# EAGLE schematic Test_Board (EAGLE 9.2.2)
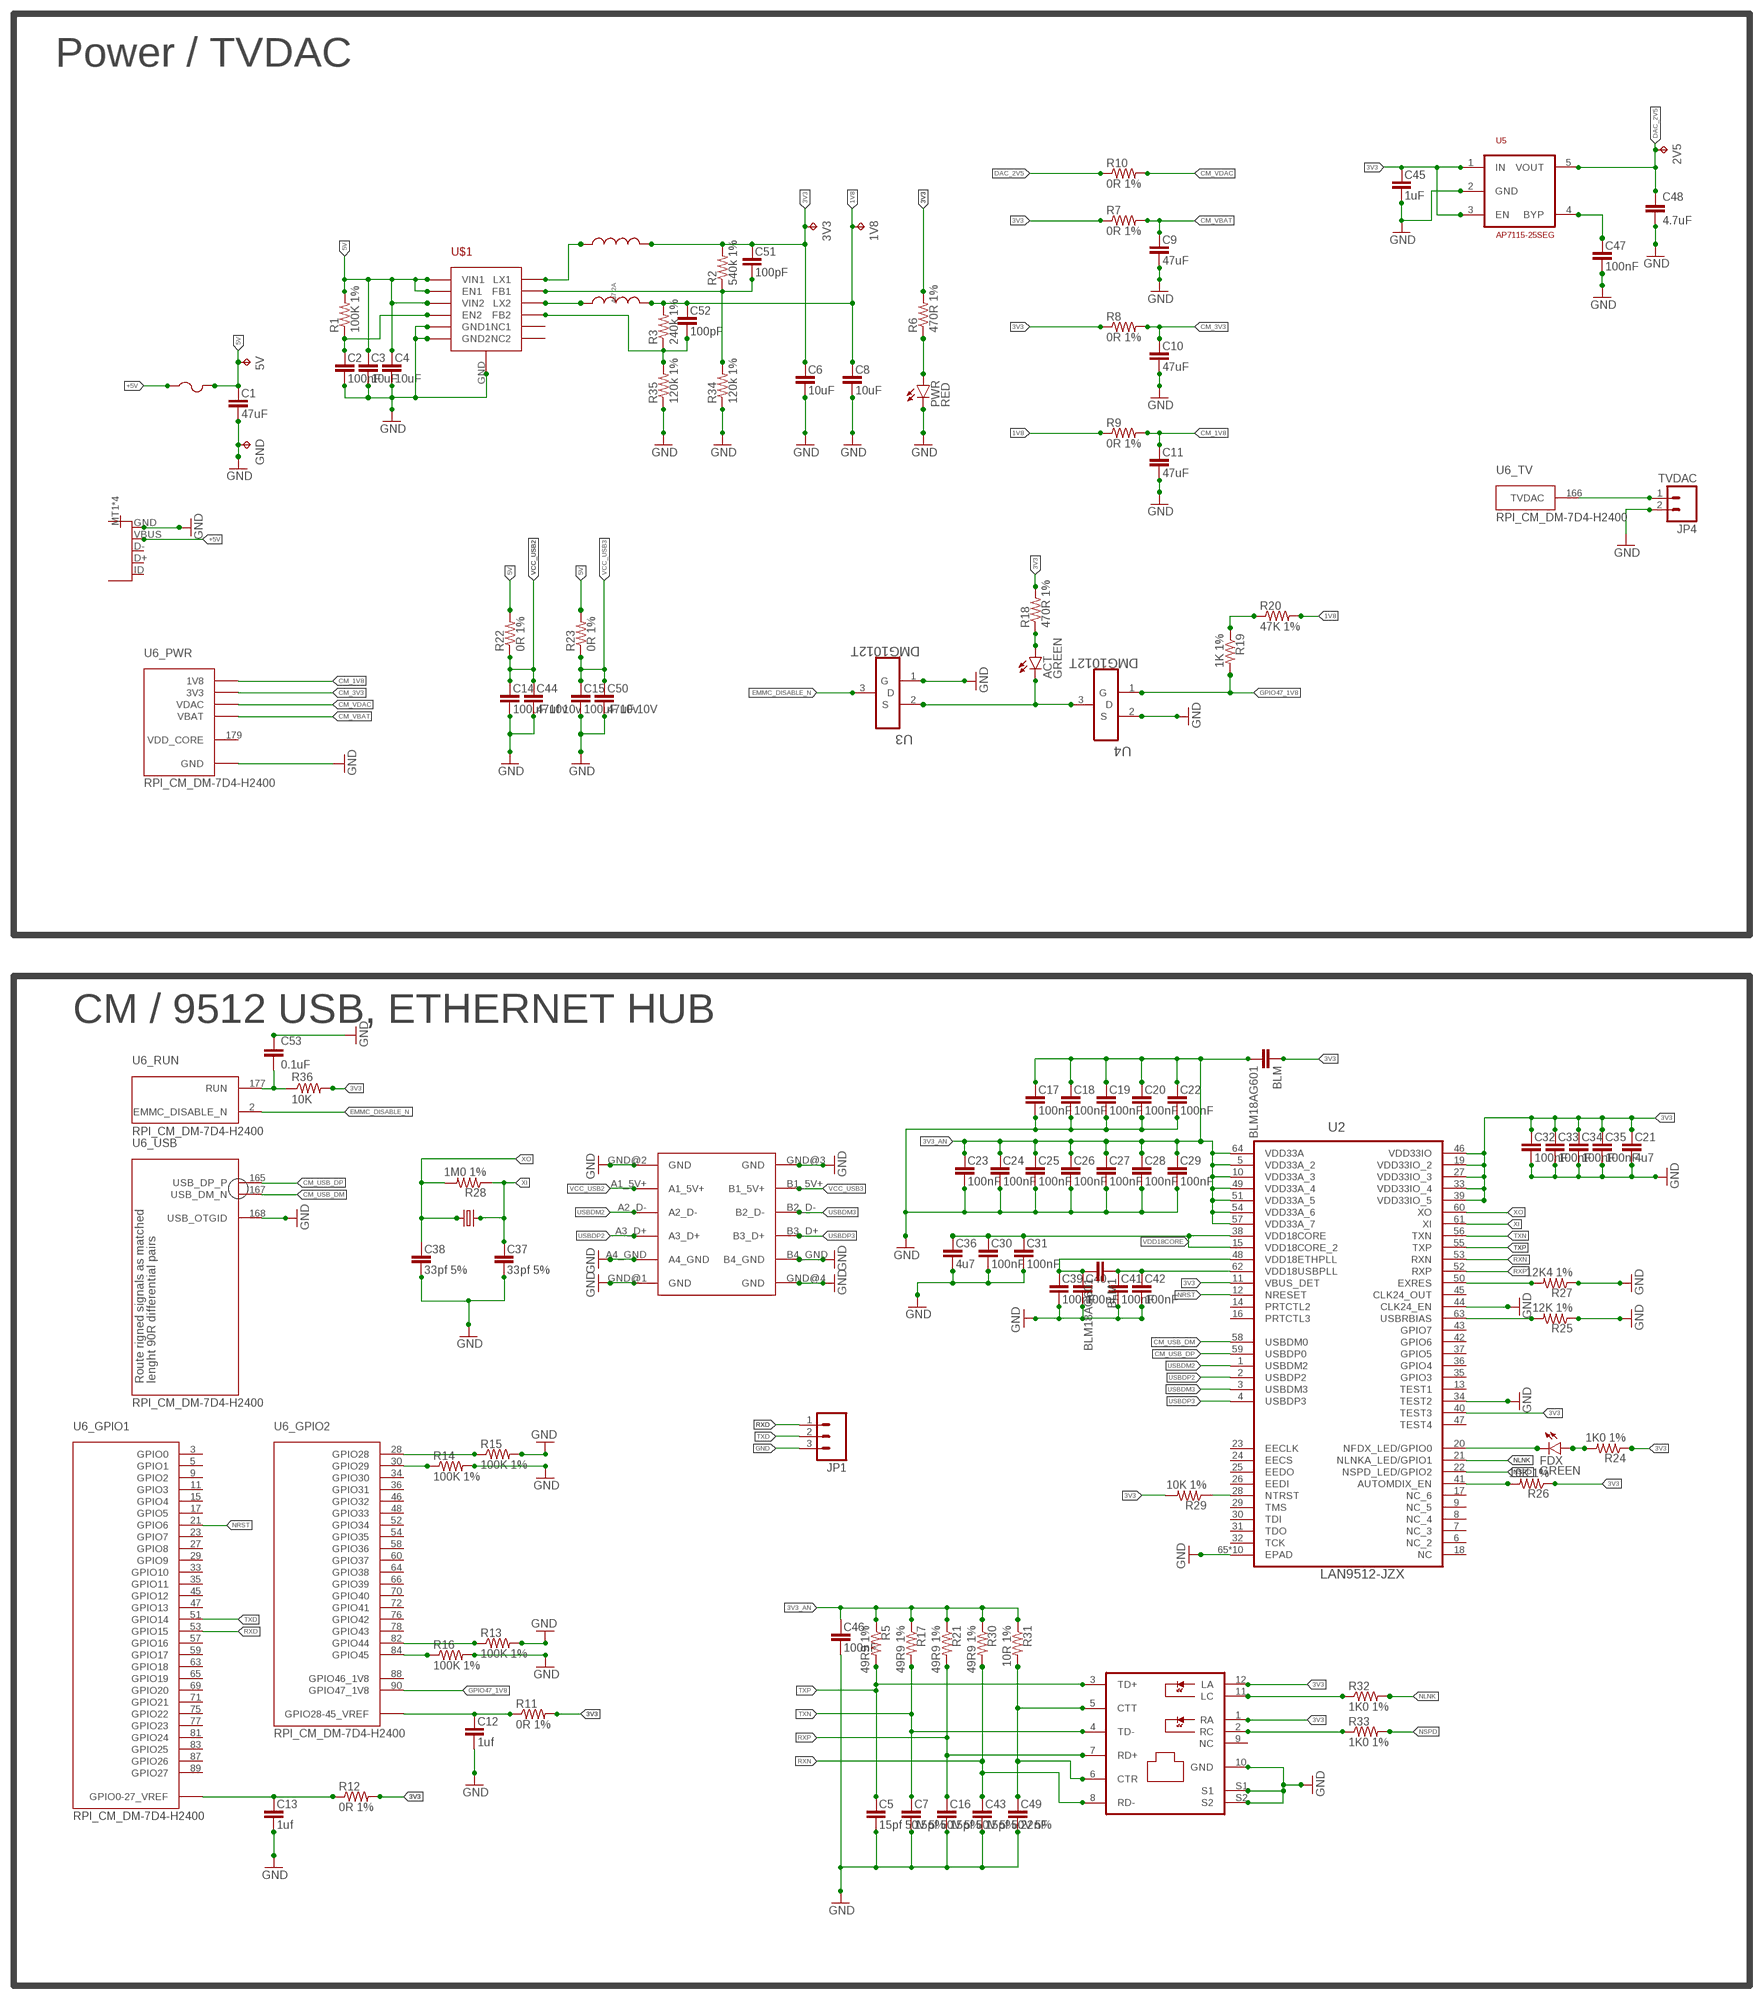
[diagram p0: schematic, sheet 1]

## Parts
1V8  TPB1,27  [B1,27]
2V5  TPB1,27  [B1,27]
3V3  TPB1,27  [B1,27]
5V  TPB1,27  [B1,27]
ACT  GREEN  LED0603  [LED-0603]
BLM  BLM18AG601  0.1UF-25V-5%(0603)  [0603-CAP]
BLM1  BLM18AG601  0.1UF-25V-5%(0603)  [0603-CAP]
C1  47uF  C_1206  [1206]
C2  100nF  C_0402  [0402]
C3  10uF  C_0805  [0805]
C4  10uF  C_0805  [0805]
C5  15pf 50V 5%  C_0402  [0402]
C6  10uF  C_0805  [0805]
C7  15pf 50V 5%  C_0402  [0402]
C8  10uF  C_0805  [0805]
C9  47uF  C_1206  [1206]
C10  47uF  C_1206  [1206]
C11  47uF  C_1206  [1206]
C12  1uf  C_0402  [0402]
C13  1uf  C_0402  [0402]
C14  100uF 10v  C_1206  [1206]
C15  100uF 10v  C_1206  [1206]
C16  15pf 50V 5%  C_0402  [0402]
C17  100nF  C_0402  [0402]
C18  100nF  C_0402  [0402]
C19  100nF  C_0402  [0402]
C20  100nF  C_0402  [0402]
C21  4u7  C_0402  [0402]
C22  100nF  C_0402  [0402]
C23  100nF  C_0402  [0402]
C24  100nF  C_0402  [0402]
C25  100nF  C_0402  [0402]
C26  100nF  C_0402  [0402]
C27  100nF  C_0402  [0402]
C28  100nF  C_0402  [0402]
C29  100nF  C_0402  [0402]
C30  100nF  C_0402  [0402]
C31  100nF  C_0402  [0402]
C32  100nF  C_0402  [0402]
C33  100nF  C_0402  [0402]
C34  100nF  C_0402  [0402]
C35  100nF  C_0402  [0402]
C36  4u7  C_0402  [0402]
C37  33pf 5%  C_0402  [0402]
C38  33pf 5%  C_0402  [0402]
C39  100nF  C_0402  [0402]
C40  100nF  C_0402  [0402]
C41  100nF  C_0402  [0402]
C42  100nF  C_0402  [0402]
C43  15pf 50V 5%  C_0402  [0402]
C44  47uf 10v  C_0805  [0805]
C45  1uF  C_0402  [0402]
C46  100nF  C_0402  [0402]
C47  100nF  C_0402  [0402]
C48  4.7uF  4.7UF-6.3V-10%(0603)0603  [0603-CAP]
C49  22nF  C_0805  [0805]
C50  47uF 10V  C_0805  [0805]
C51  100pF  C_0402  [0402]
C52  100pF  C_0402  [0402]
C53  0.1uF  0.1UF-25V-5%(0603)  [0603-CAP]
F1  PTCFUSE-1812  [1812]
FDX  GREEN  LED0603  [LED-0603]
GND  TPB1,27  [B1,27]
J1  J3011  [J30]
JP1  M03PTH  [1X03]
JP3  USB-IDMICRO  [USB-MICRO]
JP4  TVDAC  M02PTH  [1X02]
L1  4.7u 2A  INDUCTOR-SRN4018  [SRN4018]
L2  4.7u 2A  INDUCTOR-SRN4018  [SRN4018]
PWR  RED  LED0603  [LED-0603]
R1  100K 1%  RESISTOR0402-RES  [0402-RES]
R2  540k 1%  RESISTOR0402-RES  [0402-RES]
R3  240k 1%  RESISTOR0402-RES  [0402-RES]
R5  49R9 1%  RESISTOR0402-RES  [0402-RES]
R6  470R 1%  RESISTOR0402-RES  [0402-RES]
R7  0R 1%  RESISTOR0402-RES  [0402-RES]
R8  0R 1%  RESISTOR0402-RES  [0402-RES]
R9  0R 1%  RESISTOR0402-RES  [0402-RES]
R10  0R 1%  RESISTOR0402-RES  [0402-RES]
R11  0R 1%  RESISTOR0402-RES  [0402-RES]
R12  0R 1%  RESISTOR0402-RES  [0402-RES]
R13  100K 1%  RESISTOR0402-RES  [0402-RES]
R14  100K 1%  RESISTOR0402-RES  [0402-RES]
R15  100K 1%  RESISTOR0402-RES  [0402-RES]
R16  100K 1%  RESISTOR0402-RES  [0402-RES]
R17  49R9 1%  RESISTOR0402-RES  [0402-RES]
R18  470R 1%  RESISTOR0402-RES  [0402-RES]
R19  1K 1%  RESISTOR0402-RES  [0402-RES]
R20  47K 1%  RESISTOR0402-RES  [0402-RES]
R21  49R9 1%  RESISTOR0402-RES  [0402-RES]
R22  0R 1%  RESISTOR0402-RES  [0402-RES]
R23  0R 1%  RESISTOR0402-RES  [0402-RES]
R24  1K0 1%  RESISTOR0402-RES  [0402-RES]
R25  12K 1%  RESISTOR0402-RES  [0402-RES]
R26  10K 1%  RESISTOR0402-RES  [0402-RES]
R27  12K4 1%  RESISTOR0402-RES  [0402-RES]
R28  1M0 1%  RESISTOR0402-RES  [0402-RES]
R29  10K 1%  RESISTOR0402-RES  [0402-RES]
R30  49R9 1%  RESISTOR0402-RES  [0402-RES]
R31  10R 1%  RESISTOR0402-RES  [0402-RES]
R32  1K0 1%  RESISTOR0402-RES  [0402-RES]
R33  1K0 1%  RESISTOR0402-RES  [0402-RES]
R34  120k 1%  RESISTOR0402-RES  [0402-RES]
R35  120k 1%  RESISTOR0402-RES  [0402-RES]
R36  10K  RESISTOR0402-RES  [0402-RES]
U2  LAN9512-JZX  [QFN50P900X900X100-65N]
U3  DMG1012T  [SOT50P160X90-3N]
U4  DMG1012T  [SOT50P160X90-3N]
U5  AP7115-25SEG  74LVC1G79GW  [SOT353]
U6  RPI_CM_DM-7D4-H2400  [JST-DM-200P]
U$1  WDFN-12L  [WDFN-12L]
USB1  72309USB-TYPE-A  [72309]
Y1  CRYSTAL5X3  [CRYSTAL-SMD-5X3]

## Nets
1V8: 1V8.TP C8.1 C52.1 L2.P$2 R3.2 R9.1 R20.2
3V3: 3V3.TP BLM.1 C6.1 C21.1 C32.1 C33.1 C34.1 C35.1 C45.1 C51.1 J1.1(RA) J1.12(LA) L1.P$2 R2.2 R6.2 R7.1 R8.1 R11.2 R12.2 R18.2 R24.1 R26.1 R29.2 R36.2 U2.11(VBUS_DET) U2.19(VDD33IO_2) U2.27(VDD33IO_3) U2.33(VDD33IO_4) U2.39(VDD33IO_5) U2.40(TEST3) U2.46(VDD33IO) U5.1(IN) U5.3(EN)
3V3_AN: BLM.2 C17.1 C18.1 C19.1 C20.1 C22.1 C23.1 C24.1 C25.1 C26.1 C27.1 C28.1 C29.1 C46.1 R5.1 R17.1 R21.1 R30.1 R31.1 U2.5(VDD33A_2) U2.10(VDD33A_3) U2.49(VDD33A_4) U2.51(VDD33A_5) U2.54(VDD33A_6) U2.57(VDD33A_7) U2.64(VDD33A)
5V: 5V.TP C1.1 C3.1 C4.1 F1.2 R1.2 R22.2 R23.2 U$1.1(VIN2) U$1.6(EN1) U$1.7(VIN1)
+5V: F1.1 JP3.VBUS
CM_1V8: C11.1 R9.2 U6.183(_PWR:1V8) U6.184(_PWR:1V8) U6.185(_PWR:1V8) U6.186(_PWR:1V8)
CM_3V3: C10.1 R8.2 U6.191(_PWR:3V3) U6.192(_PWR:3V3) U6.193(_PWR:3V3) U6.194(_PWR:3V3)
CM_USB_DM: U2.58(USBDM0) U6.167(_USB:USB_DM_N)
CM_USB_DP: U2.59(USBDP0) U6.165(_USB:USB_DP_P)
CM_VBAT: C9.1 R7.2 U6.197(_PWR:VBAT) U6.198(_PWR:VBAT) U6.199(_PWR:VBAT) U6.200(_PWR:VBAT)
CM_VDAC: R10.2 U6.189(_PWR:VDAC) U6.190(_PWR:VDAC)
DAC_2V5: 2V5.TP C48.1 R10.1 U5.5(VOUT)
EMMC_DISABLE_N: U3.3(D) U6.2(_RUN:EMMC_DISABLE_N)
GND: C1.2 C2.2 C3.2 C4.2 C5.2 C6.2 C7.2 C8.2 C9.2 C10.2 C11.2 C12.2 C13.2 C14.2 C15.2 C16.2 C17.2 C18.2 C19.2 C20.2 C21.2 C22.2 C23.2 C24.2 C25.2 C26.2 C27.2 C28.2 C29.2 C30.2 C31.2 C32.2 C33.2 C34.2 C35.2 C36.2 C37.2 C38.2 C39.2 C40.2 C41.2 C42.2 C43.2 C44.2 C45.2 C46.2 C47.2 C48.2 C49.2 C50.2 C53.1 GND.TP J1.10(GND) J1.S1 J1.S2 JP1.3 JP3.GND JP4.2 PWR.C R13.2 R14.2 R15.2 R16.2 R25.1 R27.1 R34.1 R35.1 U2.34(TEST2) U2.44(CLK24_EN) U2.65(EPAD) U2.GND@1(EPAD) U2.GND@2(EPAD) U2.GND@3(EPAD) U2.GND@4(EPAD) U2.GND@5(EPAD) U2.GND@6(EPAD) U2.GND@7(EPAD) U2.GND@8(EPAD) U2.GND@9(EPAD) U3.1(G) U4.2(S) U5.2(GND) U6.1(_PWR:GND) U6.7(_PWR:GND) U6.13(_PWR:GND) U6.19(_PWR:GND) U6.25(_PWR:GND) U6.26(_PWR:GND) U6.31(_PWR:GND) U6.32(_PWR:GND) U6.37(_PWR:GND) U6.38(_PWR:GND) U6.43(_PWR:GND) U6.44(_PWR:GND) U6.49(_PWR:GND) U6.50(_PWR:GND) U6.55(_PWR:GND) U6.56(_PWR:GND) U6.61(_PWR:GND) U6.62(_PWR:GND) U6.67(_PWR:GND) U6.68(_PWR:GND) U6.73(_PWR:GND) U6.74(_PWR:GND) U6.79(_PWR:GND) U6.80(_PWR:GND) U6.85(_PWR:GND) U6.86(_PWR:GND) U6.91(_PWR:GND) U6.92(_PWR:GND) U6.97(_PWR:GND) U6.98(_PWR:GND) U6.103(_PWR:GND) U6.104(_PWR:GND) U6.109(_PWR:GND) U6.110(_PWR:GND) U6.115(_PWR:GND) U6.116(_PWR:GND) U6.121(_PWR:GND) U6.122(_PWR:GND) U6.127(_PWR:GND) U6.133(_PWR:GND) U6.134(_PWR:GND) U6.139(_PWR:GND) U6.140(_PWR:GND) U6.145(_PWR:GND) U6.146(_PWR:GND) U6.151(_PWR:GND) U6.152(_PWR:GND) U6.157(_PWR:GND) U6.163(_PWR:GND) U6.164(_PWR:GND) U6.168(_USB:USB_OTGID) U6.169(_PWR:GND) U6.170(_PWR:GND) U6.181(_PWR:GND) U6.182(_PWR:GND) U6.187(_PWR:GND) U6.188(_PWR:GND) U6.195(_PWR:GND) U6.196(_PWR:GND) U$1.3(GND1) U$1.9(GND2) U$1.GND USB1.A4_GND USB1.B4_GND USB1.GND@1(GND) USB1.GND@2(GND) USB1.GND@3(GND) USB1.GND@4(GND)
GPI047_CTL_1V8: R19.1 R20.1
GPIO47_1V8: R19.2 U4.1(G) U6.90(_GPIO2:GPIO47_1V8)
N$1: L1.P$1 U$1.8(LX1)
N$2: C51.2 R2.1 R34.2 U$1.4(FB1)
N$3: C2.1 R1.1 U$1.12(EN2)
N$4: L2.P$1 U$1.2(LX2)
N$5: C12.1 R11.1 U6.41(_GPIO2:GPIO28-45_VREF) U6.42(_GPIO2:GPIO28-45_VREF)
N$6: C52.2 R3.1 R35.2 U$1.10(FB2)
N$7: PWR.A R6.1
N$8: C13.1 R12.1 U6.39(_GPIO1:GPIO0-27_VREF) U6.40(_GPIO1:GPIO0-27_VREF)
N$9: R15.1 U6.28(_GPIO2:GPIO28)
N$10: R14.1 U6.30(_GPIO2:GPIO29)
N$11: R13.1 U6.82(_GPIO2:GPIO44)
N$12: R16.1 U6.84(_GPIO2:GPIO45)
N$13: FDX.A R24.2
N$14: ACT.C U3.2(S) U4.3(D)
N$15: ACT.A R18.1
N$16: R25.2 U2.63(USBRBIAS)
N$17: C53.2 R36.1 U6.177(_RUN:RUN)
N$18: JP4.1 U6.166(_TV:TVDAC)
N$21: C47.1 U5.4(BYP)
N$22: BLM1.1 C41.1 C42.1 U2.62(VDD18USBPLL)
N$23: BLM1.2 C39.1 C40.1 U2.48(VDD18ETHPLL)
N$24: R26.2 U2.41(AUTOMDIX_EN)
N$25: R27.2 U2.50(EXRES)
N$26: R29.1 U2.28(NTRST)
N$27: J1.11(LC) R32.1
N$28: J1.2(RC) R33.1
N$29: C49.1 J1.5(CTT) J1.6(CTR) R31.2
N$30: FDX.C U2.20(NFDX_LED/GPIO0)
NLNK: R32.2 U2.21(NLNKA_LED/GPIO1)
NRST: U2.12(NRESET) U6.21(_GPIO1:GPIO6)
NSPD: R33.2 U2.22(NSPD_LED/GPIO2)
RXD: JP1.1 U6.53(_GPIO1:GPIO15)
RXN: C43.1 J1.8(RD-) R30.2 U2.53(RXN)
RXP: C16.1 J1.7(RD+) R21.2 U2.52(RXP)
TXD: JP1.2 U6.51(_GPIO1:GPIO14)
TXN: C7.1 J1.4(TD-) R17.2 U2.56(TXN)
TXP: C5.1 J1.3(TD+) R5.2 U2.55(TXP)
USBDM2: U2.1(USBDM2) USB1.A2_D-
USBDM3: U2.3(USBDM3) USB1.B2_D-
USBDP2: U2.2(USBDP2) USB1.A3_D+
USBDP3: U2.4(USBDP3) USB1.B3_D+
VCC_USB2: C14.1 C44.1 R22.1 USB1.A1_5V+
VCC_USB3: C15.1 C50.1 R23.1 USB1.B1_5V+
VDD18CORE: C30.1 C31.1 C36.1 U2.15(VDD18CORE_2) U2.38(VDD18CORE)
XI: C37.1 R28.1 U2.61(XI) Y1.3
XO: C38.1 R28.2 U2.60(XO) Y1.1
Unconnected: J1.9(NC) JP3.D+ JP3.D- JP3.ID JP3.MT1(SHELL) JP3.MT2(SHELL) JP3.P$1(SHELL) JP3.P$2(SHELL) U2.6(NC_2) U2.7(NC_3) U2.8(NC_4) U2.9(NC_5) U2.13(TEST1) U2.14(PRTCTL2) U2.16(PRTCTL3) U2.17(NC_6) U2.18(NC) U2.23(EECLK) U2.24(EECS) U2.25(EEDO) U2.26(EEDI) U2.29(TMS) U2.30(TDI) U2.31(TDO) U2.32(TCK) U2.35(GPIO3) U2.36(GPIO4) U2.37(GPIO5) U2.42(GPIO6) U2.43(GPIO7) U2.45(CLK24_OUT) U2.47(TEST4) U6.3(_GPIO1:GPIO0) U6.5(_GPIO1:GPIO1) U6.9(_GPIO1:GPIO2) U6.11(_GPIO1:GPIO3) U6.15(_GPIO1:GPIO4) U6.17(_GPIO1:GPIO5) U6.23(_GPIO1:GPIO7) U6.27(_GPIO1:GPIO8) U6.29(_GPIO1:GPIO9) U6.33(_GPIO1:GPIO10) U6.34(_GPIO2:GPIO30) U6.35(_GPIO1:GPIO11) U6.36(_GPIO2:GPIO31) U6.45(_GPIO1:GPIO12) U6.46(_GPIO2:GPIO32) U6.47(_GPIO1:GPIO13) U6.48(_GPIO2:GPIO33) U6.52(_GPIO2:GPIO34) U6.54(_GPIO2:GPIO35) U6.57(_GPIO1:GPIO16) U6.58(_GPIO2:GPIO36) U6.59(_GPIO1:GPIO17) U6.60(_GPIO2:GPIO37) U6.63(_GPIO1:GPIO18) U6.64(_GPIO2:GPIO38) U6.65(_GPIO1:GPIO19) U6.66(_GPIO2:GPIO39) U6.69(_GPIO1:GPIO20) U6.70(_GPIO2:GPIO40) U6.71(_GPIO1:GPIO21) U6.72(_GPIO2:GPIO41) U6.75(_GPIO1:GPIO22) U6.76(_GPIO2:GPIO42) U6.77(_GPIO1:GPIO23) U6.78(_GPIO2:GPIO43) U6.81(_GPIO1:GPIO24) U6.83(_GPIO1:GPIO25) U6.87(_GPIO1:GPIO26) U6.88(_GPIO2:GPIO46_1V8) U6.89(_GPIO1:GPIO27) U6.93(_DSI:DSI0_D1_N) U6.94(_DSI:DSI1_D0_P) U6.95(_DSI:DSI0_D1_P) U6.96(_DSI:DSI1_D0_N) U6.99(_DSI:DSI0_D0_N) U6.100(_DSI:DSI1_C_P) U6.101(_DSI:DSI0_D0_P) U6.102(_DSI:DSI1_C_N) U6.105(_DSI:DSI0_C_N) U6.106(_DSI:DSI1_D3_P) U6.107(_DSI:DSI0_C_P) U6.108(_DSI:DSI1_D3_N) U6.111(_HDMI:HDMI_CK_N) U6.112(_DSI:DSI1_D2_P) U6.113(_HDMI:HDMI_CK_P) U6.114(_DSI:DSI1_D2_N) U6.117(_HDMI:HDMI_D0_N) U6.118(_DSI:DSI1_D1_P) U6.119(_HDMI:HDMI_D0_P) U6.120(_DSI:DSI1_D1_N) U6.123(_HDMI:HDMI_D1_N) U6.125(_HDMI:HDMI_D1_P) U6.129(_HDMI:HDMI_D2_N) U6.131(_HDMI:HDMI_D2_P) U6.135(_CAM:CAM1_D3_P) U6.136(_CAM:CAM0_D0_P) U6.137(_CAM:CAM1_D3_N) U6.138(_CAM:CAM0_D0_N) U6.141(_CAM:CAM1_D2_P) U6.142(_CAM:CAM0_C_P) U6.143(_CAM:CAM1_D2_N) U6.144(_CAM:CAM0_C_N) U6.147(_CAM:CAM1_C_P) U6.148(_CAM:CAM0_D1_P) U6.149(_CAM:CAM1_C_N) U6.150(_CAM:CAM0_D1_N) U6.153(_CAM:CAM1_D1_P) U6.155(_CAM:CAM1_D1_N) U6.159(_CAM:CAM1_D0_P) U6.161(_CAM:CAM1_D0_N) U6.171(_HDMI:HDMI_CEC) U6.172(_JTAG:VC_TSRT_N) U6.173(_HDMI:HDMI_SDA) U6.174(_JTAG:VC_TDI) U6.175(_HDMI:HDMI_SCL) U6.176(_JTAG:VC_TMS) U6.178(_JTAG:VC_TDO) U6.179(_PWR:VDD_CORE) U6.180(_JTAG:VC_TCK) U$1.5(NC1) U$1.11(NC2)

## Notes on the sheet
- Power / TVDAC
- CM / 9512 USB, ETHERNET HUB

## Library data of the parts
1V8 2V5 3V3 5V GND = testpad:TP: Test pad
ACT FDX PWR = SparkFun-LED:LED: LEDs Standard schematic elements and footprints for 5mm, 3mm, 1206, and 0603 sized LEDs. 5mm - Spark Fun Electronics SKU : COM-00529 (and others)
BLM BLM1 = SparkFun-Capacitors:0.1UF-25V-5%(0603): CAP-08604; PROD_ID: CAP-08604; VALUE: 0.1uF
C1 C2 C5 C7 C9-C43 C45-C47 C51 C52 = C:C
C3 C4 C6 C8 C44 C49 C50 = C:C; MN: TDK Corp.; PARTNO: C2012X5R1Cxxxxxxx; VID: DK
C48 = SparkFun-Capacitors:4.7UF-6.3V-10%(0603): CAP-08280; PROD_ID: CAP-08280
C53 = SparkFun-Capacitors:0.1UF-25V-5%(0603): CAP-08604; PROD_ID: CAP-08604
F1 = PTCFUSE:PTCFUSE
J1 = J3011:J3011
JP1 = SparkFun-Connectors:M03: Header 3 Standard 3-pin 0.1" header. Use with straight break away headers (SKU : PRT-00116), right angle break away headers (PRT-00553), swiss pins (PRT-00743), machine pins (PRT-00117), and female headers (PRT-00115). Molex polarized connector foot print use with SKU : PRT-08232 with associated crimp pins and housings.
JP3 = USB-ID:USB-ID; PROD_ID: CONN-09505
JP4 = SparkFun-Connectors:M02: Standard 2-pin 0.1" header. Use with - straight break away headers ( PRT-00116) - right angle break away headers (PRT-00553) - swiss pins (PRT-00743) - machine pins (PRT-00117) - female headers (PRT-00115) Molex polarized connector foot print use with: PRT-08233 with associated crimp pins and housings. 2.54_SCREWTERM for use with PRT-10571. 3.5mm Screw Terminal footprints for PRT-08084 5mm Screw Terminal footprints for use with PRT-08433
L1 = INDUCTOR:INDUCTOR
L2 = INDUCTOR:INDUCTOR; L2: 4u7 2A
R1-R3 R5-R35 = RESISTORS:RESISTOR
R36 = SparkFun-Passives:RESISTOR: Resistor Basic schematic elements and footprints for 0603, 1206, and PTH resistors.
U2 = LAN9512:LAN9512-JZX: IC, USB2 - ENET CNTRL 2-PORT HUB, 64VQFN; MPN: LAN9512-JZX; OC_FARNELL: 2292586; OC_NEWARK: 66W1988; PACKAGE: 64VQFN; SUPPLIER: Microchip
U3 U4 = DMG1012-T:DMG1012T: TRANSISTOR; MPN: DMG1012T; PACKAGE: SOT-523-3; SUPPLIER: Diodes Inc
U5 = AP7115-25SEG:74LVC1G79
U6 = Compute Module:RPI_CM: Raspberry Pi Compute Module As anounced in this blog post http://www.raspberrypi.org/raspberry-pi-compute-module-new-product/ Based on infomation from this schematic http://www.raspberrypi.org/wp-content/uploads/2014/04/RPI-CM-V1_1-SCHEMATIC.pdf Footprint is unproven and no matching part confimed as of yet
U$1 = PAM2306AY:WDFN-12L: PAM2306AY
USB1 = 72309:72309
Y1 = CRYSTAL:CRYSTAL